# EAGLE design RainbowLED_2021_05_02_A (EAGLE 9.6.1)
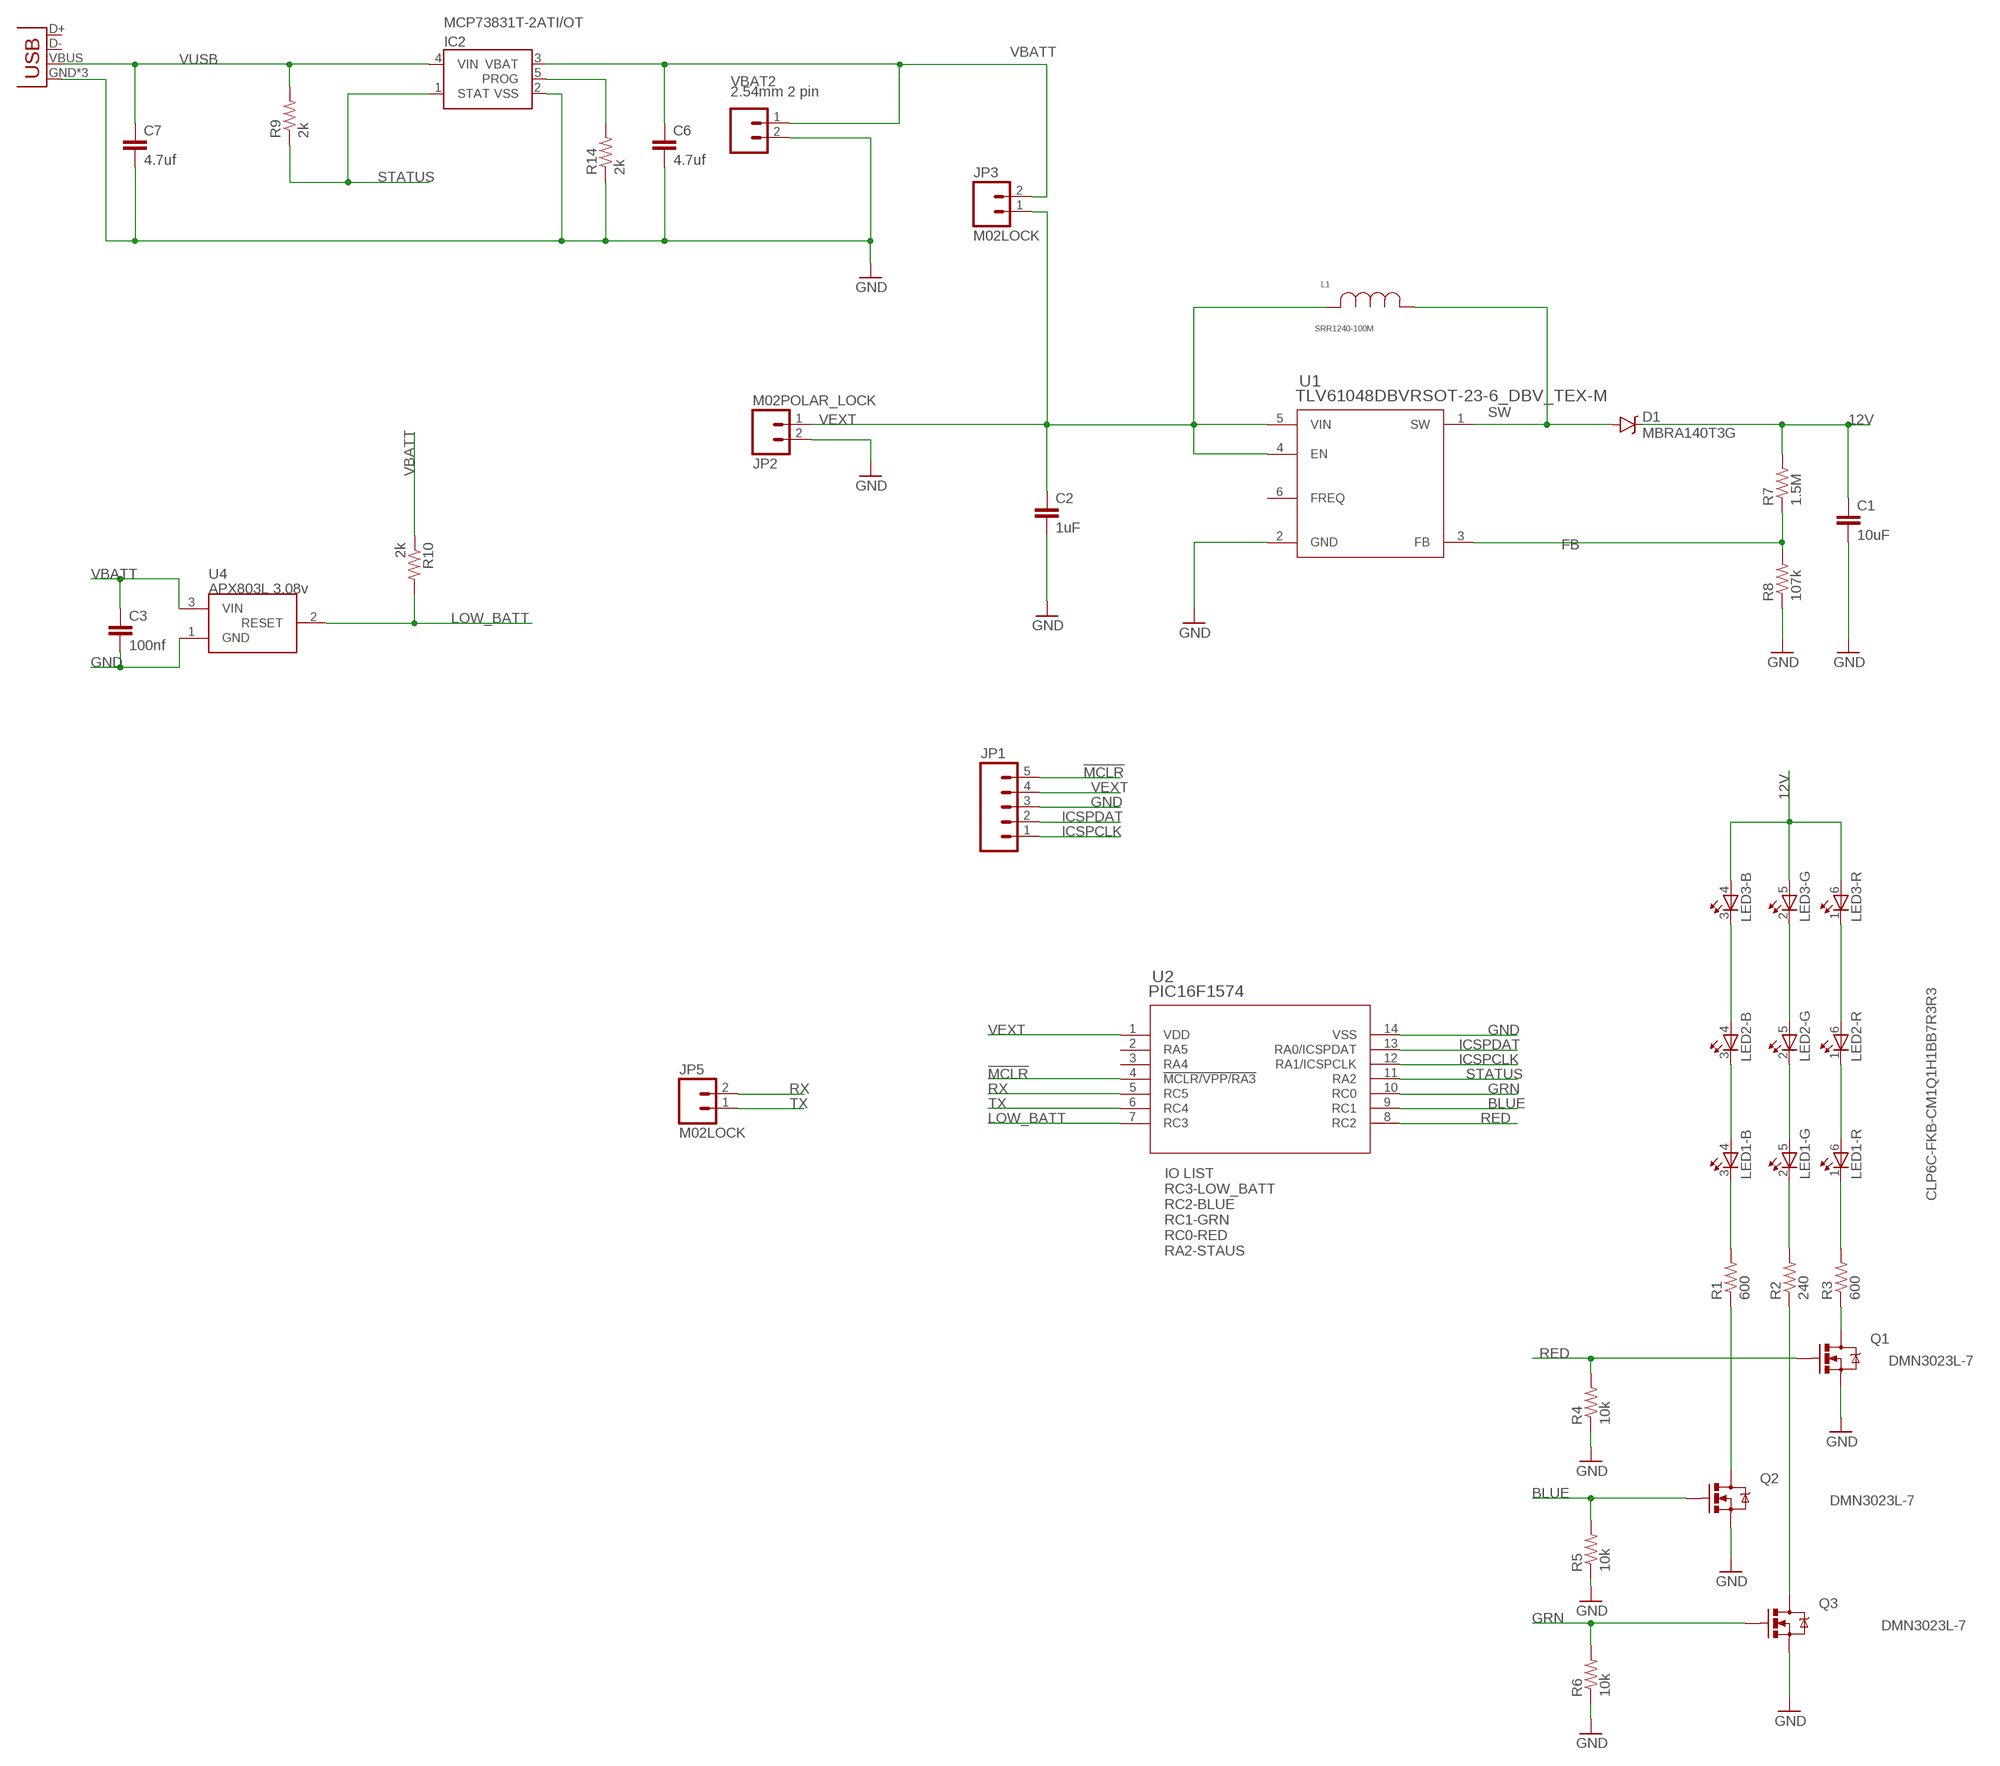
[diagram p0: schematic, sheet 1]

## Parts
C1  10uF  CAP1206  [1206]
C2  1uF  CAP1206  [1206]
C3  100nf  CAP1206  [1206]
C6  4.7uf  CAP1206  [1206]
C7  4.7uf  CAP1206  [1206]
D1  MBRA140T3G  DIODE-SCHOTTKY-MBRA140  [SMA-DIODE]
IC2  MCP73831T-2ATI/OT  MCP73831  [SOT23-5]
JP1  M05LOCK  [1X05_LOCK]
JP2  M02POLAR_LOCK  [MOLEX-1X2_LOCK]
JP3  M02LOCK  [1X02_LOCK]
JP4  USB-MICROB  [USB-MICROB]
JP5  M02LOCK  [1X02_LOCK]
L1  SRR1240-100M  [IND_BOURNS_SRR1240]
LED1  CLX6F-FKC-CKNNQDGBB7A363  OVSTRGBBCR8  [PLCC-6]
LED2  CLX6F-FKC-CKNNQDGBB7A363  OVSTRGBBCR8  [PLCC-6]
LED3  CLX6F-FKC-CKNNQDGBB7A363  OVSTRGBBCR8  [PLCC-6]
Q1  DMN3023L-7  MOSFET-NCHANNELBSS138  [SOT23-3]
Q2  DMN3023L-7  MOSFET-NCHANNELBSS138  [SOT23-3]
Q3  DMN3023L-7  MOSFET-NCHANNELBSS138  [SOT23-3]
R1  600  RESISTOR1206  [1206]
R2  240  RESISTOR1206  [1206]
R3  600  RESISTOR1206  [1206]
R4  10k  RESISTOR1206  [1206]
R5  10k  RESISTOR1206  [1206]
R6  10k  RESISTOR1206  [1206]
R7  1.5M  RESISTOR1206  [1206]
R8  107k  RESISTOR1206  [1206]
R9  2k  RESISTOR1206  [1206]
R10  2k  RESISTOR1206  [1206]
R14  2k  RESISTOR1206  [1206]
U1  TLV61048DBVRSOT-23-6_DBV_TEX-M  [SOT-23-6_DBV_TEX-M]
U2  PIC16F1574  PIC16F1503-I/SL  [SOIC14_SL]
U4  APX803L 3.08v  ADP160  [SOT23]
VBAT2  2.54mm 2 pin  M02JST-PTH-VERT  [JST-2-PTH-VERT]

## Nets
12V: C1.1 D1.C LED3.4(-B:A) LED3.5(-G:A) LED3.6(-R:A) R7.2
!MCLR: JP1.5 U2.4(!MCLR/VPP/RA3)
BLUE: Q2.1(G) R5.2 U2.9(RC1)
FB: R7.1 R8.2 U1.3(FB)
GND: C1.2 C2.2 C3.2 C6.2 C7.2 IC2.2(VSS) JP1.3 JP2.2 JP4.GND JP4.MT1(GND) JP4.MT2(GND) Q1.2(S) Q2.2(S) Q3.2(S) R4.1 R5.1 R6.1 R8.1 R14.1 U1.2(GND) U2.14(VSS) U4.1(GND) VBAT2.2
GRN: Q3.1(G) R6.2 U2.10(RC0)
ICSPCLK: JP1.1 U2.12(RA1/ICSPCLK)
ICSPDAT: JP1.2 U2.13(RA0/ICSPDAT)
LOW_BATT: R10.2 U2.7(RC3) U4.2(RESET)
N$1: LED2.4(-B:A) LED3.3(-B:C)
N$2: LED1.4(-B:A) LED2.3(-B:C)
N$3: LED2.5(-G:A) LED3.2(-G:C)
N$4: LED1.5(-G:A) LED2.2(-G:C)
N$5: LED2.6(-R:A) LED3.1(-R:C)
N$6: LED1.6(-R:A) LED2.1(-R:C)
N$7: LED1.3(-B:C) R1.2
N$8: LED1.2(-G:C) R2.2
N$9: LED1.1(-R:C) R3.2
N$10: Q1.3(D) R3.1
N$11: Q2.3(D) R1.1
N$12: Q3.3(D) R2.1
N$25: IC2.5(PROG) R14.2
RED: Q1.1(G) R4.2 U2.8(RC2)
RX: JP5.2 U2.5(RC5)
STATUS: IC2.1(STAT) R9.1 U2.11(RA2)
SW: D1.A L1.1 U1.1(SW)
TX: JP5.1 U2.6(RC4)
VBATT: C3.1 C6.1 IC2.3(VBAT) JP3.2 R10.1 U4.3(VIN) VBAT2.1
VEXT: C2.1 JP1.4 JP2.1 JP3.1 L1.2 U1.4(EN) U1.5(VIN) U2.1(VDD)
VUSB: C7.1 IC2.4(VIN) JP4.VBUS R9.2
Unconnected: JP4.D+ JP4.D- U1.6(FREQ) U2.2(RA5) U2.3(RA4)

## Notes on the sheet
- ‎CLP6C-FKB-CM1Q1H1BB7R3R3‎
- IO LIST
  RC3-LOW_BATT
  RC2-BLUE 
  RC1-GRN 
  RC0-RED
  RA2-STAUS
- ‎DMN3023L-7‎
- ‎DMN3023L-7‎
- ‎DMN3023L-7‎

## Library data of the parts
C1-C3 C6 C7 = SparkFun-Capacitors:CAP: Capacitor Standard 0603 ceramic capacitor, and 0.1" leaded capacitor.
D1 = SparkFun-DiscreteSemi:DIODE-SCHOTTKY: Schottky diodes in SFE's production catalog BAT20J 1A 23V 0.62Vf RB751 120mA 40V 0.37Vf PMEG4005EJ 0.5A 40V 0.42Vf MBRA140 1A 40V 0.5Vf B340A 3A 40V SMA; PROD_ID: DIO-08053; VALUE: MBRA140
IC2 = SparkFun-PowerIC:MCP73831: Miniature single cell, fully integrated Li-Ion, Li-polymer charge management controller http://ww1.microchip.com/downloads/en/DeviceDoc/21984a.pdf IC-09995; PROD_ID: IC-09995
JP1 = SparkFun-Connectors:M05: Header 5 Standard 5-pin 0.1" header. Use with straight break away headers (SKU : PRT-00116), right angle break away headers (PRT-00553), swiss pins (PRT-00743), machine pins (PRT-00117), and female headers (PRT-00115). Molex polarized connector foot print use with SKU : PRT-08230 with associated crimp pins and housings.
JP2 JP3 JP5 VBAT2 = SparkFun-Connectors:M02: Standard 2-pin 0.1" header. Use with - straight break away headers ( PRT-00116) - right angle break away headers (PRT-00553) - swiss pins (PRT-00743) - machine pins (PRT-00117) - female headers (PRT-00115) Molex polarized connector foot print use with: PRT-08233 with associated crimp pins and housings. 2.54_SCREWTERM for use with PRT-10571. 3.5mm Screw Terminal footprints for PRT-08084 5mm Screw Terminal footprints for use with PRT-08432
JP4 = SparkFun-Connectors:USB: USB Connectors USB-B-PTH is fully proven SKU : PRT-00139/CONN-08278 USB-miniB is fully proven SKU : PRT-00587 USB-A-PCB is untested. USB-A-H is throughly reviewed, but untested. Spark Fun Electronics SKU : PRT-00437 USB-B-SMT is throughly reviewed, but untested. Needs silkscreen touching up. USB-A-S has not been used/tested USB-MB-H has not been used/tested USB-MICROB has been used. CONN-09505; PROD_ID: CONN-09505
L1 = SRR1240:SRR1240-100M; MANUFACTURER_PART_NUMBER: SRR1240100M; VENDOR: Bourns Electronics
LED1-LED3 = adam - ics:OVSTRGBBCR8: Full Color PLCC6 LED OVSTRGBBCR8 Source: www.optekinc.com .. ovstrgbbcr8.pdf
Q1-Q3 = SparkFun-DiscreteSemi:MOSFET-NCHANNEL: Common NMOSFET Parts MFG P/N Store ID Prod ID FDD8780 TRANS-09984 SI7820DN TRANS-11055 FDS6630A IC-08089 2N7002PW TRANS-11151 FQP30N06L COM-10213 TRANS-10060 BSS123LT1G TRANS-08345 BSS138 TRANS-00830 BS170 2N7000; PROD_ID: TRANS-00830
R1-R8 = SparkFun-Passives:RESISTOR: Resistor Basic schematic elements and footprints for 0603, 1206, and PTH resistors.
R9 R10 R14 = SparkFun-Resistors:RESISTOR: Resistor Basic schematic elements and footprints for 0603, 1206, and PTH resistors.
U1 = tlv61048:TLV61048DBVR; BUILT_BY: EMA_Cory; COPYRIGHT: Copyright (C) 2018 Accelerated Designs. All rights reserved; DATASHEET: https://www.ti.com/lit/ds/symlink/tlv61048.pdf?ts=1593038356361&ref_url=https%253A%252F%252Fwww.ti.com%252Fstore%252Fti%252Fen%252Fp%252Fproduct%252F%253Fp%253DTLV61048DBVR; MANUFACTURER_PART_NUMBER: TLV61048DBVR; SOURCELIBRARY: TI_2020-06-27; VENDOR: Texas Instruments
U2 = PIC16F15323:PIC16F1503-I/SL; BUILT_BY: EMA_UL_Team; MANUFACTURER_PART_NUMBER: PIC16F1503-I/SL; VENDOR: Microchip
U4 = APX803L:ADP160: RESET GENERATOR SOT23

## Board
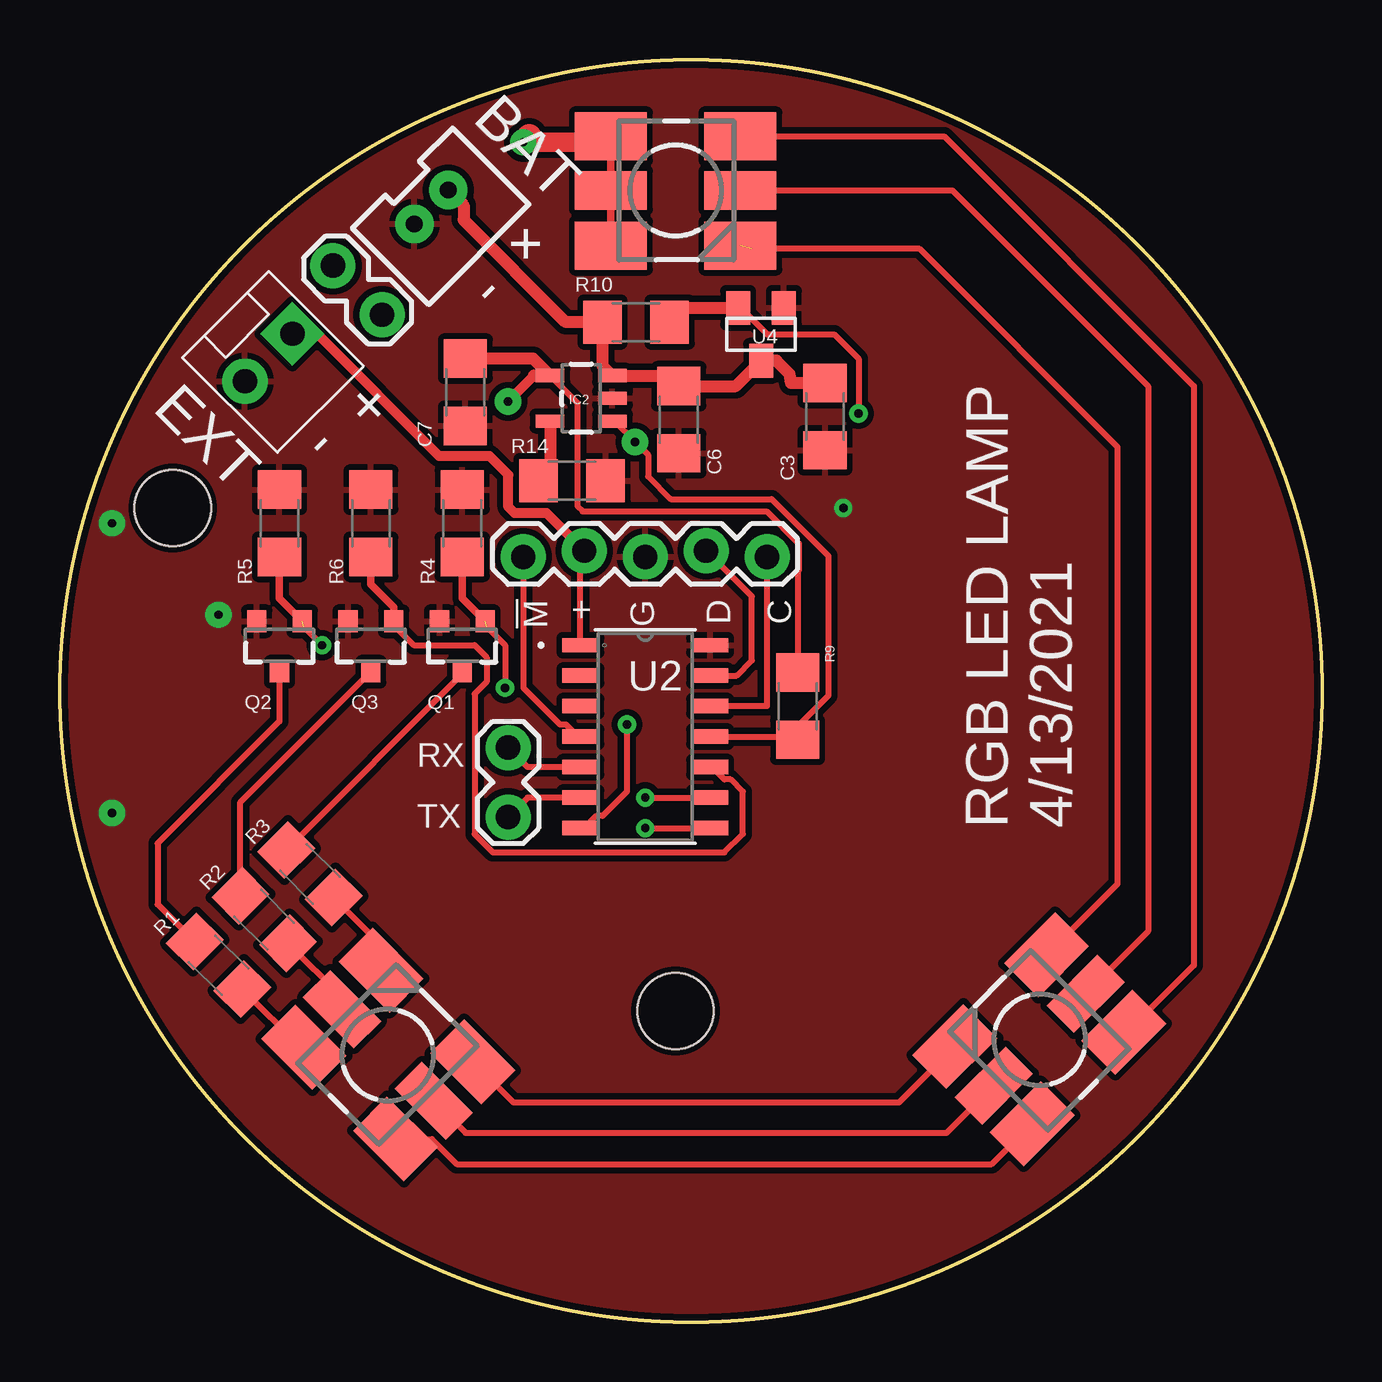
[diagram p1: board, top side]
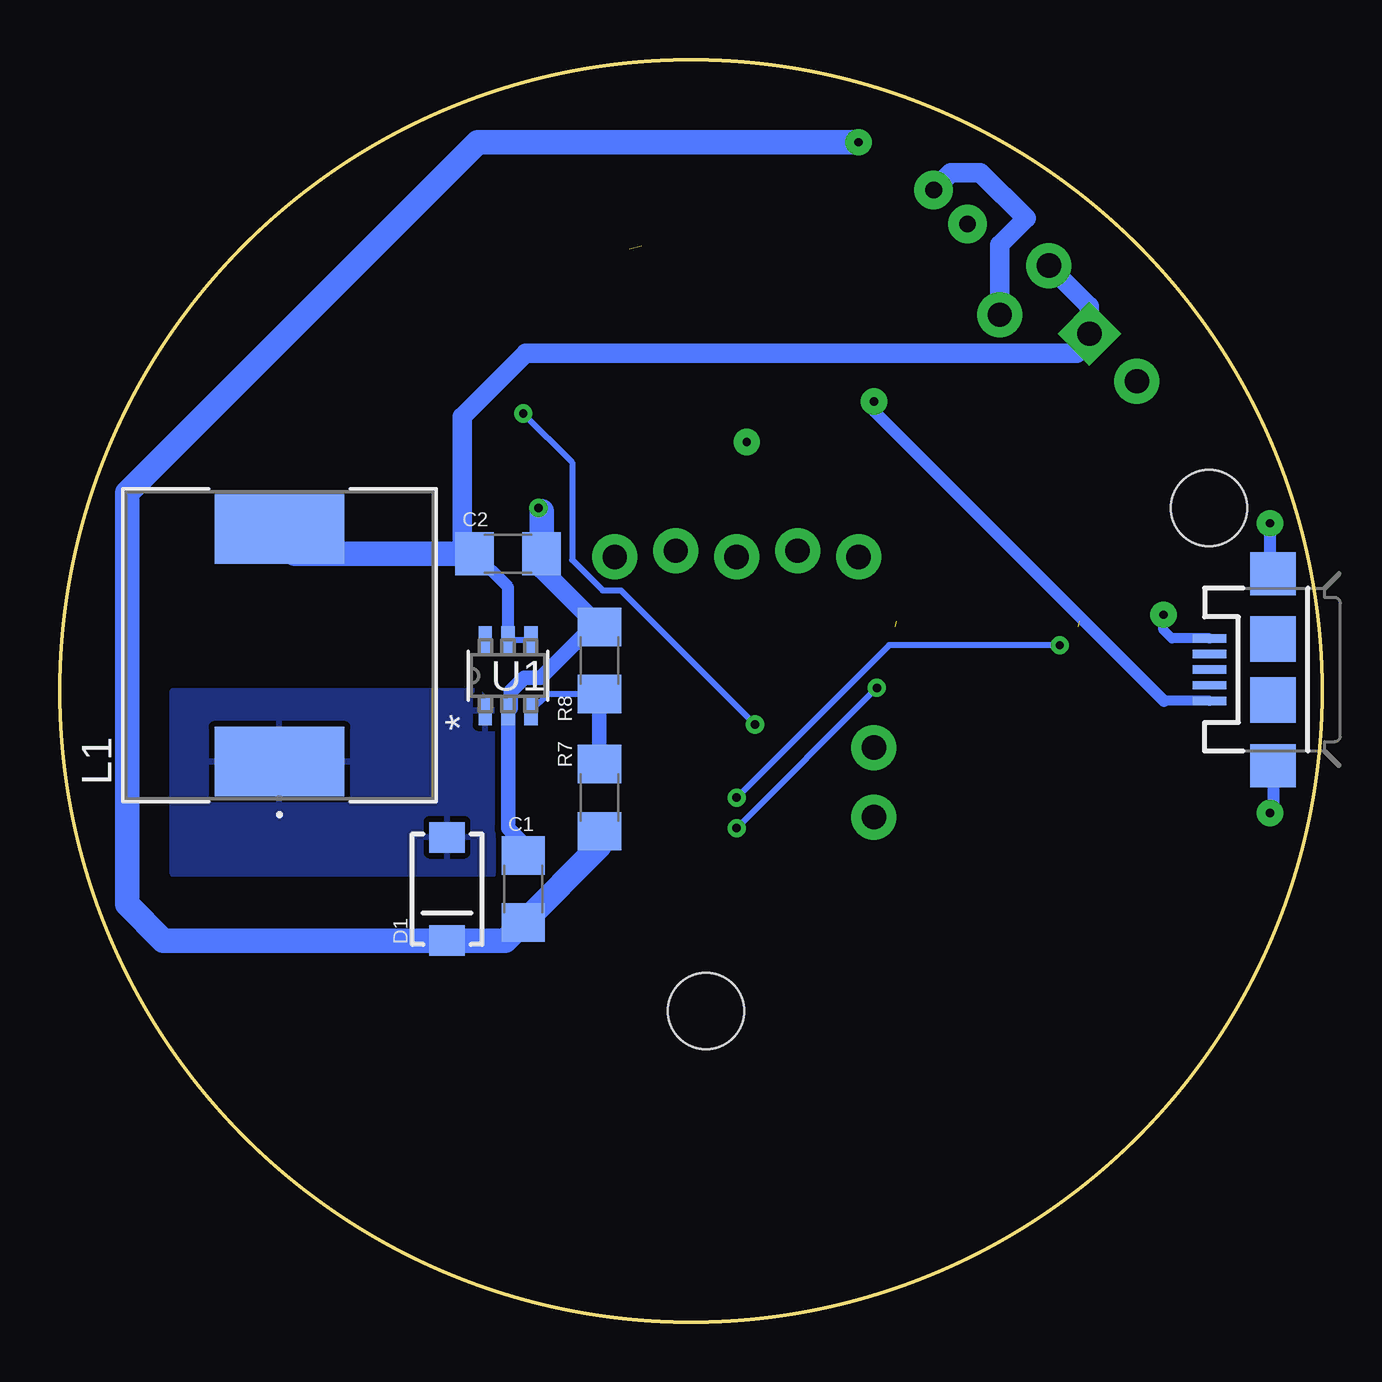
[diagram p2: board, bottom side, seen from below]

Size 52.58 x 52.58 mm. Coordinates in mm from the lower left corner, seen from the top.
Outline: circle at 26.29,26.29 radius 26.29
Copper layers (1*16): Top 0.035mm / dielectric 1.5mm / Bottom 0.035mm
Design rules "default": minimum track width 10mil, minimum drill 0.35mm, track to track 10mil, track to pad 10mil, pad to pad 10mil, via to via 10mil, smd to smd 6mil, copper to edge 10mil, drill to drill 6mil, minimum pad ring 10mil, minimum via ring 8mil, stop-mask expansion 4mil, vias tented up to drill 0mil, thermal gap 10mil
Holes 3.17 mm at 25.65,12.95 4.7,33.91

### Footprints (pad centres in the part's own frame; a part is rotated, then mirrored left to right if it is on the bottom)
1206 = smd 1.6 x 1.8: 1 -1.4,0; 2 1.4,0
SMA-DIODE = smd 1.27 x 1.47: A -2.15,0; C 2.15,0
SOT23-5 = smd 0.55 x 1.2: 1 -0.95,-1.3; 2 0,-1.3; 3 0.95,-1.3; 4 0.95,1.3; 5 -0.95,1.3
1X05_LOCK = drill 1.016 pad 1.88: 1 0,0.127; 2 2.54,-0.127; 3 5.08,0.127; 4 7.62,-0.127; 5 10.16,0.127
MOLEX-1X2_LOCK = drill 1.016 pad 1.88 square: 1 -0.127,0 | drill 1.016 pad 1.88: 2 2.667,0
1X02_LOCK = drill 1.016 pad 1.88: 1 -0.178,0; 2 2.718,0
USB-MICROB = smd 0.35 x 1.4: D+ 0,2.65; D- -0.65,2.65; GND 1.3,2.65; ID 0.65,2.65; VBUS -1.3,2.65 | smd 1.8 x 1.9: MT1 -4,0; MT2 4,0 | smd 1.9 x 1.9: P$1 -1.27,0; P$2 1.27,0
IND_BOURNS_SRR1240 = smd 2.896 x 5.41: 1 -4.851,0; 2 4.851,0
PLCC-6 = smd 3 x 2: 1 -2.7,2.4; 3 -2.7,-2.15; 4 2.7,-2.15; 6 2.7,2.4 | smd 3 x 1.6: 2 -2.7,0.1; 5 2.7,0.1
SOT23-3 = smd 0.8 x 0.9: 1 -0.95,-1; 2 0.95,-1; 3 0,1.1
SOT-23-6_DBV_TEX-M = smd 1.181 x 0.559: 1 -1.467,0.95; 2 -1.467,0; 3 -1.467,-0.95; 4 1.467,-0.95; 5 1.467,0; 6 1.467,0.95
SOIC14_SL = smd 1.5 x 0.6: 1 -2.7,3.81; 2 -2.7,2.54; 3 -2.7,1.27; 4 -2.7,0; 5 -2.7,-1.27; 6 -2.7,-2.54; 7 -2.7,-3.81; 8 2.7,-3.81; 9 2.7,-2.54; 10 2.7,-1.27; 11 2.7,0; 12 2.7,1.27; 13 2.7,2.54; 14 2.7,3.81
SOT23 = smd 1 x 1.4: 1 -0.95,-1.1; 2 0.95,-1.1; 3 0,1.1
JST-2-PTH-VERT = drill 0.7 pad 1.6: 1 -1,-0.55; 2 1,-0.55

### Placement (x,y rotation side)
C1  33.27,18.03 90 bottom
C2  33.91,32 0 bottom
C3  31.88,37.72 270 top
C6  25.78,37.59 270 top
C7  16.89,38.73 270 top
D1  36.45,18.03 270 bottom
IC2  21.72,38.48 90 top
JP1  29.46,32 180 top
JP2  9.59,41.08 225 top
JP3  11.5,43.88 315 top
JP4  2.03,27.18 90 bottom
JP5  18.67,21.21 90 top
L1  43.43,28.19 90 bottom
LED1  13.59,11.05 315 top
LED2  40.89,11.68 45 top
LED3  25.65,47.24 180 top
Q1  16.76,28.19 180 top
Q2  9.14,28.19 180 top
Q3  12.95,28.19 180 top
R1  6.6,14.86 315 top
R2  8.51,16.76 315 top
R3  10.41,18.67 315 top
R4  16.76,33.27 270 top
R5  9.14,33.27 270 top
R6  12.95,33.27 270 top
R7  30.1,21.84 270 bottom
R8  30.1,27.56 270 bottom
R9  30.73,25.65 90 top
R10  24,41.66 0 top
R14  21.34,35.05 180 top
U1  33.91,26.92 90 bottom
U2  24.38,24.38 0 top
U4  29.21,41.15 180 top
VBAT2  15.86,46.06 225 top

### Tracks (layer width: path | path; a pad name or v marks a point on that pad's centre or on a via)
12V  (via drill 0.35 pad 1.1)
  Top 0.305: LED3.5 LED3.6 22.95,49.15 LED3.4
  Top 0.813: v19.3,49.15 22.95,49.15
  Top 1.016: v19.3,49.15 19.55,49.39
  Bottom 1.016: R7.2 30.1,19.81 C1.1 34.02,15.88 D1.C 48.27,15.88 49.78,17.4 49.78,34.54 35.18,49.15 v19.3,49.15
!MCLR
  Top 0.254: JP1.5 19.3,26.42 20.83,24.89 21.08,24.89 21.59,24.38 U2.4
BLUE  (via drill 0.35)  (1 unrouted)
  Top 0.254: v24.38,21.84 U2.9 | 10.16,28.96 v10.92,28.19
  Top 0.305: Q2.1 9.14,30.14 R5.2
  Bottom 0.254: v24.38,21.84 18.03,28.19 v10.92,28.19
FB
  Bottom 0.254: R8.2 32.26,26.16 U1.3
  Bottom 0.61: R8.2 R7.1
GND  (via drill 0.35, 0.35 pad 1.1)
  Bottom 0.254: 32.51,33.78 v32.64,33.91
  Bottom 0.305: 33.27,19.94 C1.2 | U1.2 33.91,26.29
  Bottom 0.406: JP4.GND 6.25,28.48 6.6,28.83 v6.6,29.46
  Bottom 0.508: 6.6,29.13 v6.6,29.46 | JP4.MT1 2.03,21.34 v2.16,21.21 | JP4.MT2 2.16,31.3 v2.16,33.27
  Bottom 0.61: 33.27,19.94 33.91,20.57 U1.2 33.8,25.57 33.8,26.28 33.23,26.84 32.54,26.84 30.43,28.96 R8.1
  Bottom 0.813: C2.2 32.51,31.37 R8.1
  Bottom 1.016: C2.2 32.51,33.78
  pour Top: 19.94,57.4 51.69,57.4 66.29,42.8 66.29,5.97 44.07,-16.26 8.51,-16.26 -15.62,7.87 -15.62,35.81 8.51,59.94 17.4,59.94
GRN
  Top 0.254: U2.10 27.18,23.11 27.69,22.61 27.94,22.61 28.45,22.1 28.45,20.32 27.69,19.56 18.03,19.56 17.27,20.32 17.27,26.16 17.78,26.67 17.78,27.69 17.27,28.19 14.73,28.19 13.97,28.96 Q3.1
  Top 0.305: Q3.1 13.9,29.78 12.95,30.73 R6.2
ICSPCLK
  Top 0.254: JP1.1 29.45,31.87 29.45,25.65 U2.12
ICSPDAT
  Top 0.254: U2.13 28.19,26.92 28.83,27.56 28.83,30.23 JP1.2
LOW_BATT  (via drill 0.35)
  Top 0.254: v23.62,24.89 23.62,22.1 22.61,21.08 22.35,21.08 21.84,20.57 U2.7 | v33.27,37.85 33.27,40.13 32.26,41.15 29.46,41.15 28.45,42.16 U4.2
  Top 0.508: R10.2 25.99,42.25 U4.2
  Bottom 0.254: v23.62,24.89 29.21,30.48 29.97,30.48 31.24,31.75 31.24,35.81 v33.27,37.85
N$1
  Top 0.254: LED3.3 36.84,49.39 47.24,38.99 47.24,14.86 44.07,11.68 44.07,11.82 LED2.4
N$2
  Top 0.254: LED1.4 15.49,7.62 16.54,6.57 38.82,6.57 LED2.3
N$3
  Top 0.254: LED3.2 37.18,47.14 45.34,38.99 45.34,16.27 LED2.5
N$4
  Top 0.254: LED1.5 16.91,7.87 36.94,7.87 LED2.2
N$5  (1 unrouted)
  Top 0.254: LED2.6 44.07,18.25 44.07,36.45 35.81,44.7 28.83,44.7
N$6
  Top 0.254: LED1.6 18.89,9.14 34.96,9.14 LED2.1
N$7
  Top 0.254: R1.2 10.02,11.44 LED1.3
N$8
  Top 0.254: R2.2 11.75,13.52 LED1.2
N$9
  Top 0.254: R3.2 12.95,16.13 12.95,14.86 13.16,14.66 LED1.1
  Top 0.406: 11.55,17.68 R3.2
N$10
  Top 0.254: R3.1 16.76,27 Q1.3
N$11
  Top 0.254: Q2.3 9.14,25.02 4.06,19.94 4.06,17.4 R1.1
N$12
  Top 0.254: R2.1 7.52,21.66 Q3.3
N$25
  Top 0.508: IC2.5 20.42,35.53 R14.2
RED  (via drill 0.35)  (1 unrouted)
  Top 0.254: v24.38,20.57 U2.8 | v18.54,26.42 18.54,28.19 17.78,28.96
  Top 0.305: Q1.1 16.76,30.14 R4.2
  Bottom 0.254: v18.54,26.42 v24.38,20.57
RX
  Top 0.254: U2.5 19.48,23.11 JP5.2
STATUS  (via drill 0.35 pad 1.1)
  Top 0.254: U2.11 30.6,24.38 30.67,24.32 | 30.67,24.32 R9.1 | 30.67,24.32 30.67,24.75 32.02,26.1 32.02,31.91 29.65,34.28 25.45,34.28 24.5,35.23 24.5,36.12 v23.96,36.66 23.09,37.53
  Top 0.406: IC2.1 23.09,37.53
  Top 0.508: IC2.1 23.3,37.53
SW
  pour Bottom (isolate 0.254): 47.88,26.29 35.18,26.29 34.54,25.65 34.54,18.67 47.88,18.67
TX
  Top 0.254: U2.6 19.48,21.84 JP5.1
VBATT
  Top 0.508: C3.1 30.46,39.12 30.4,39.49 29.84,40.05 U4.3 28.15,38.99 C6.1 25.34,39.43 IC2.3 22.6,39.84 R10.1 21.08,41.66 16.81,45.92 16.81,46.52 VBAT2.1
  Bottom 0.813: JP3.2 13.42,44.87 12.32,45.97 14.22,47.88 15.46,47.88 VBAT2.1
VEXT
  Top 0.254: U2.1 21.68,31.97 JP1.4
  Top 0.406: JP1.4 20.28,33.7 18.95,33.7 18.68,33.96 18.68,35.3 17.9,36.08 15.8,36.08 10.71,41.17 JP2.1
  Bottom 0.254: U1.4 U1.5 | L1.2 43.43,33.02 43.62,32.83
  Bottom 0.508: U1.5 33.91,30.6 C2.1
  Bottom 0.813: JP3.1 9.68,42.32 JP2.1 10.04,40.81 10.04,40.53 10.22,40.36 33.17,40.36 35.81,37.72 35.81,32.51 C2.1
  Bottom 1.016: C2.1 42.8,32 43.62,32.83
VUSB  (via drill 0.35 pad 1.1)
  Top 0.254: R9.2 30.73,31.28 30.78,31.33 30.78,32.42 29.44,33.77 21.78,33.77 21.55,33.99 21.55,38.29 IC2.4
  Top 0.406: v18.67,38.35 19.75,39.43
  Top 0.508: C7.1 19.71,40.13 IC2.4 19.75,39.43
  Bottom 0.406: JP4.VBUS 6.59,25.88
  Bottom 0.508: 6.59,25.88 18.67,37.96 v18.67,38.35

### Text on the board
tNames: BAT | + | - | + | EXT | - | !M | + | G | D | C | RX | TX | RGB LED LAMP / 4/13/2021